# EAGLE design tvc-soundmagic-v1.3 (EAGLE 8.3.1)
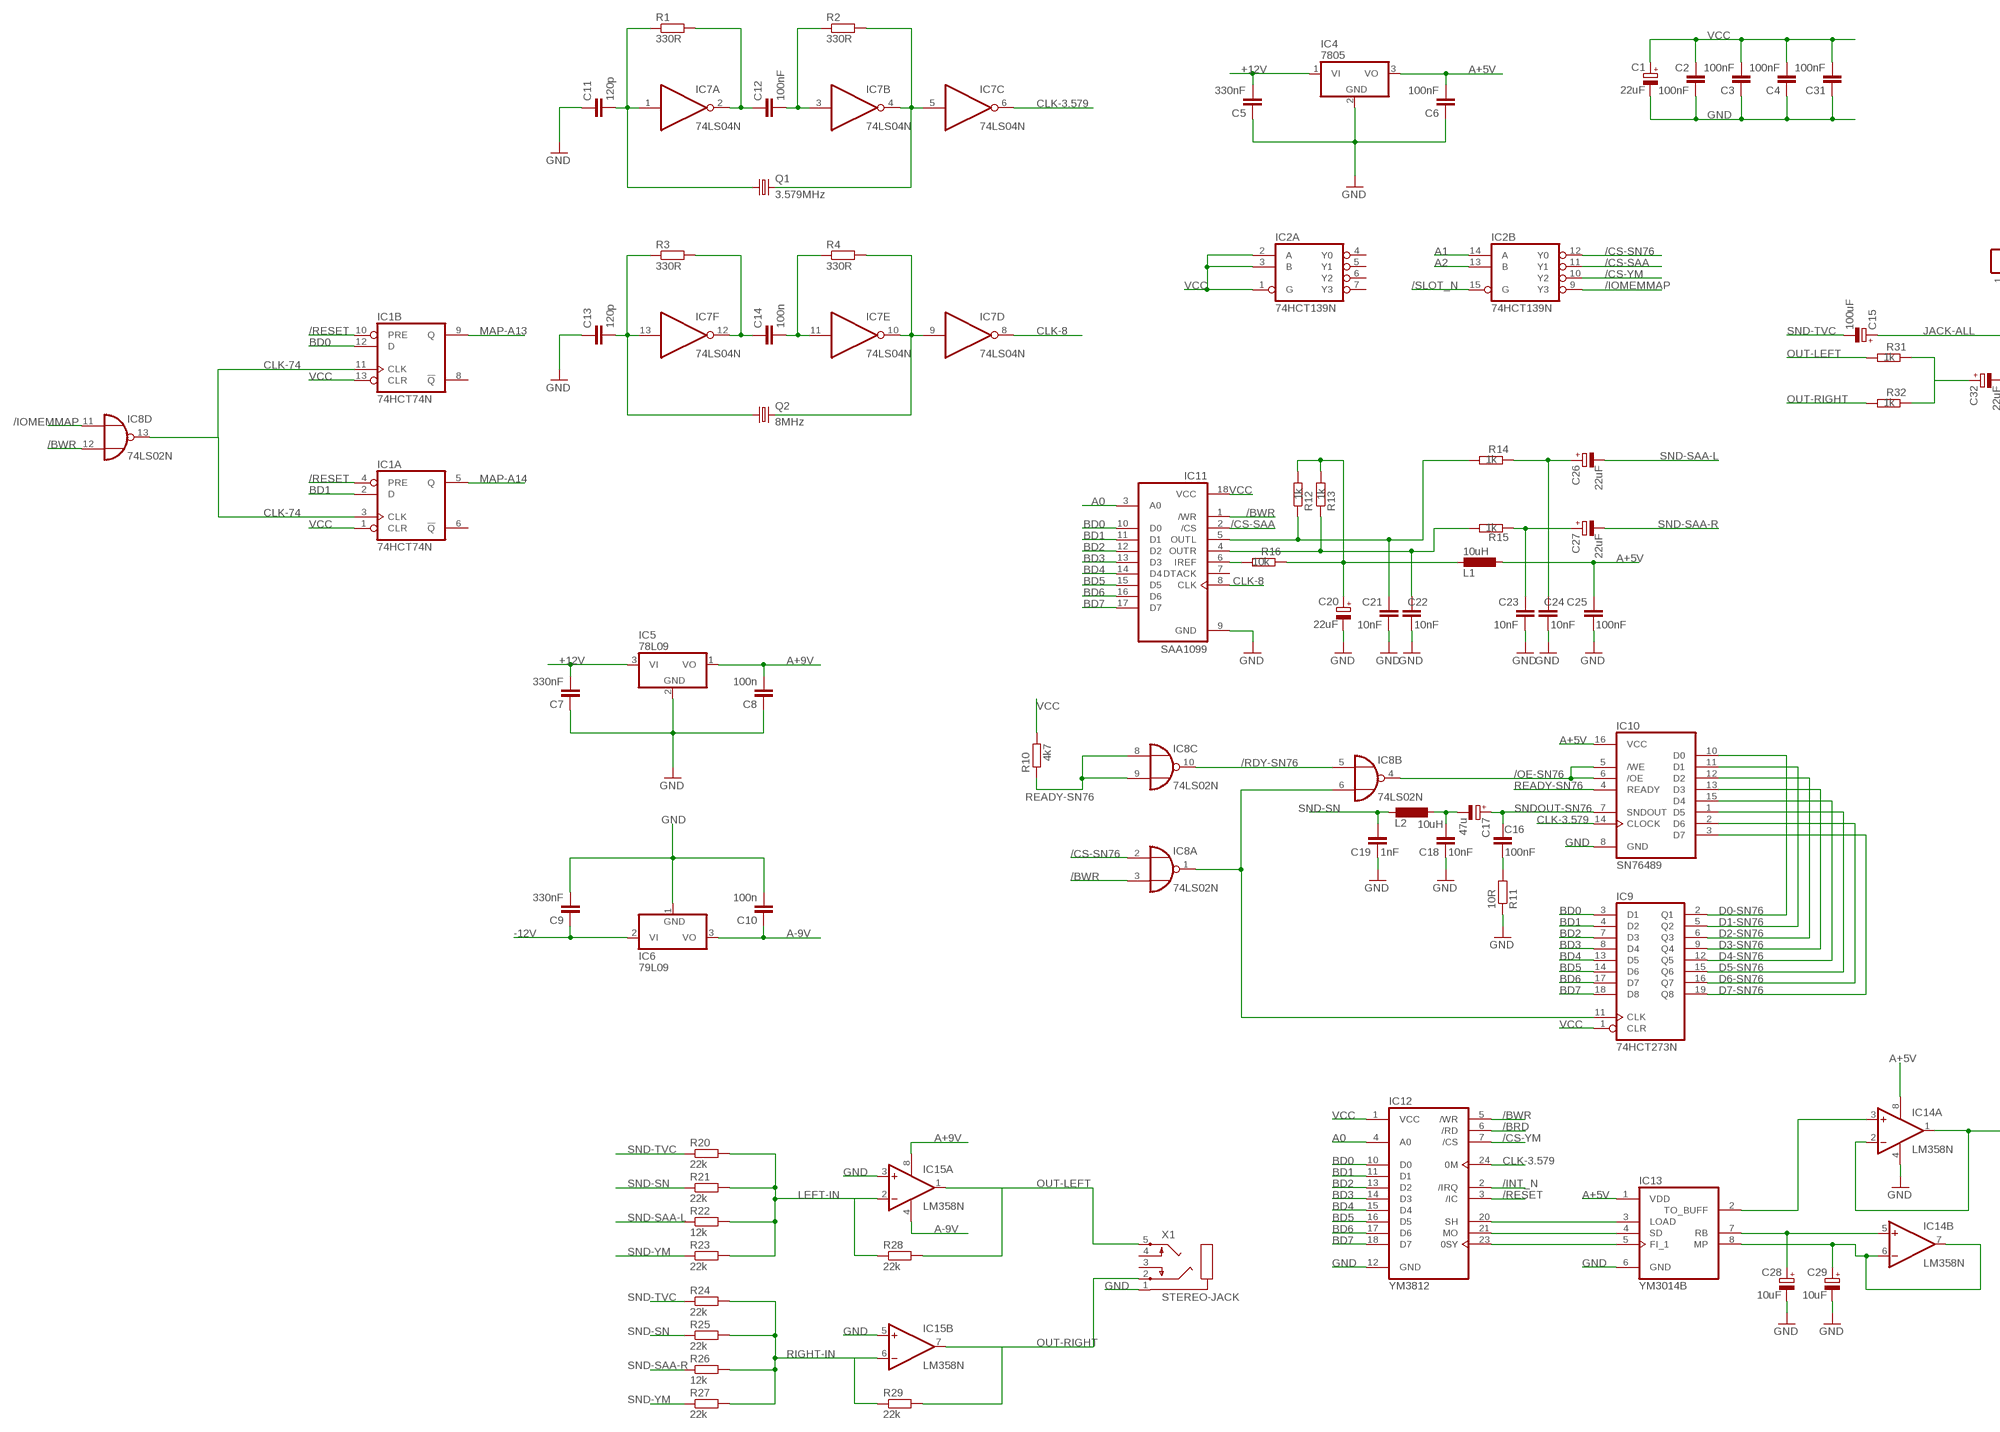
[diagram p0: schematic, sheet 1, part 1 of 2]
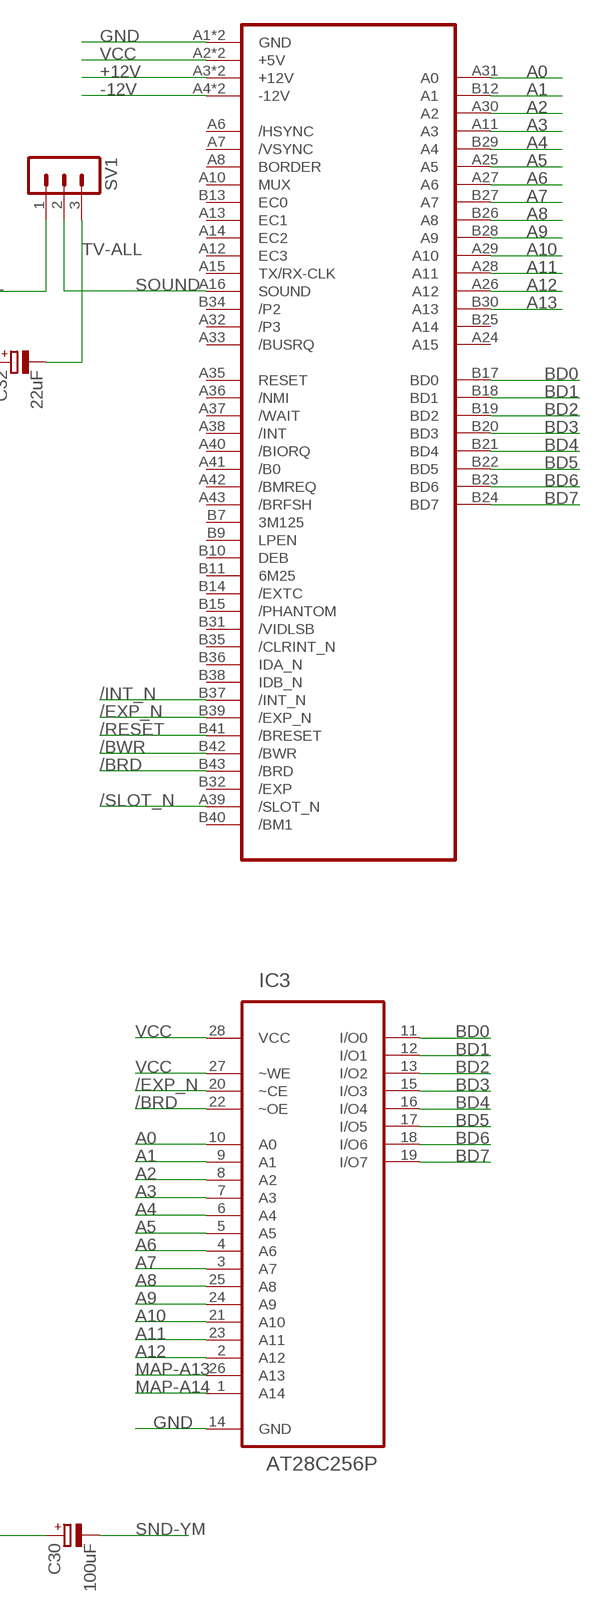
[diagram p1: schematic, sheet 1, part 2 of 2]

## Parts
C1  22uF  CPOL-EUE2.5-5  [E2,5-5]
C2  100nF  C2.5/2  [C2.5-2]
C3  100nF  C-EU025-024X044  [C025-024X044]
C4  100nF  C-EU025-024X044  [C025-024X044]
C5  330nF  C-EU050-025X075  [C050-025X075]
C6  100nF  C-EU025-024X044  [C025-024X044]
C7  330nF  C-EU050-025X075  [C050-025X075]
C8  100n  C-EU025-024X044  [C025-024X044]
C9  330nF  C-EU050-025X075  [C050-025X075]
C10  100n  C-EU025-024X044  [C025-024X044]
C11  120p  C-EU025-024X044  [C025-024X044]
C12  100nF  C-EU025-024X044  [C025-024X044]
C13  120p  C-EU025-024X044  [C025-024X044]
C14  100n  C-EU025-024X044  [C025-024X044]
C15  100uF  CPOL-EUE2.5-5  [E2,5-5]
C16  100nF  C2.5/2  [C2.5-2]
C17  47u  CPOL-EUE2.5-6  [E2,5-6]
C18  10nF  C2.5/2  [C2.5-2]
C19  1nF  C2.5/2  [C2.5-2]
C20  22uF  CPOL-EUE2.5-5  [E2,5-5]
C21  10nF  C2.5/2  [C2.5-2]
C22  10nF  C2.5/2  [C2.5-2]
C23  10nF  C2.5/2  [C2.5-2]
C24  10nF  C2.5/2  [C2.5-2]
C25  100nF  C2.5/2  [C2.5-2]
C26  22uF  CPOL-EUE2.5-5  [E2,5-5]
C27  22uF  CPOL-EUE2.5-5  [E2,5-5]
C28  10uF  CPOL-EUE2.5-5  [E2,5-5]
C29  10uF  CPOL-EUE2.5-5  [E2,5-5]
C30  100uF  CPOL-EUE2.5-5  [E2,5-5]
C31  100nF  C-EU025-024X044  [C025-024X044]
C32  22uF  CPOL-EUE2.5-5  [E2,5-5]
IC1  74HCT74N  [DIL14]
IC2  74HCT139N  [DIL16]
IC3  AT28C256P  [DIL28-6]
IC4  7805  7805T  [TO220H]
IC5  78L09  [TO92]
IC6  79L09  [TO92]
IC7  74LS04N  [DIL14]
IC8  74LS02N  [DIL14]
IC9  74HCT273N  [DIL20]
IC10  SN76489  [DIL16]
IC11  SAA1099  [DIL18]
IC12  YM3812  [DIL24-6]
IC13  YM3014B  [DIL08]
IC14  LM358N  [DIL08]
IC15  LM358N  [DIL08]
L1  10uH  L-EU0207/10  [0207/10]
L2  10uH  L-EU0207/10  [0207/10]
Q1  3.579MHz  CRYSTALHC49S  [HC49/S]
Q2  8MHz  CRYSTALHC49S  [HC49/S]
R1  330R  R-EU_0204/5  [0204/5]
R2  330R  R-EU_0204/5  [0204/5]
R3  330R  R-EU_0204/5  [0204/5]
R4  330R  R-EU_0204/5  [0204/5]
R10  4k7  R-EU_0207/7  [0207/7]
R11  10R  R-EU_0207/7  [0207/7]
R12  1k  R-EU_0207/7  [0207/7]
R13  1k  R-EU_0207/7  [0207/7]
R14  1k  R-EU_0207/7  [0207/7]
R15  1k  R-EU_0207/7  [0207/7]
R16  10k  R-EU_0207/7  [0207/7]
R20  22k  R-EU_0204/5  [0204/5]
R21  22k  R-EU_0204/5  [0204/5]
R22  12k  R-EU_0204/5  [0204/5]
R23  22k  R-EU_0204/5  [0204/5]
R24  22k  R-EU_0204/5  [0204/5]
R25  22k  R-EU_0204/5  [0204/5]
R26  12k  R-EU_0204/5  [0204/5]
R27  22k  R-EU_0204/5  [0204/5]
R28  22k  R-EU_0204/5  [0204/5]
R29  22k  R-EU_0204/5  [0204/5]
R31  1k  R-EU_0207/7  [0207/7]
R32  1k  R-EU_0207/7  [0207/7]
SV1  MA03-1  [MA03-1]
U$3  TVC-EXP-HBA-COMMON  [TVC-EXP-EDGE]
X1  STEREO-JACK  [ST-JACK-100]

## Nets
+12V [power]: C5.2 C7.2 IC4.1(VI) IC5.3(VI) U$3.A3(+12V) U$3.B3(+12V)
-12V [power]: C9.1 IC6.2(VI) U$3.A4(-12V) U$3.B4(-12V)
/BRD: IC3.22(~OE) IC12.6(/RD) U$3.B43(/BRD)
/BWR: IC8.3(A:I1) IC8.12(D:I1) IC11.1(/WR) IC12.5(/WR) U$3.B42(/BWR)
/CS-SAA: IC2.11(B:Y1) IC11.2(/CS)
/CS-SN76: IC2.12(B:Y0) IC8.2(A:I0)
/CS-YM: IC2.10(B:Y2) IC12.7(/CS)
/EXP_N: IC3.20(~CE) U$3.B39(/EXP_N)
/INT_N: IC12.2(/IRQ) U$3.B37(/INT_N)
/IOMEMMAP: IC2.9(B:Y3) IC8.11(D:I0)
/OE-SN76: IC8.4(B:O) IC10.5(/WE) IC10.6(/OE)
/RDY-SN76: IC8.5(B:I0) IC8.10(C:O)
/RESET: IC1.4(A:PRE) IC1.10(B:PRE) IC12.3(/IC) U$3.B41(/BRESET)
/SLOT_N: IC2.15(B:G) U$3.A39(/SLOT_N)
A0: IC3.10(A0) IC11.3(A0) IC12.4(A0) U$3.A31(A0)
A1: IC2.14(B:A) IC3.9(A1) U$3.B12(A1)
A2: IC2.13(B:B) IC3.8(A2) U$3.A30(A2)
A3: IC3.7(A3) U$3.A11(A3)
A4: IC3.6(A4) U$3.B29(A4)
A5: IC3.5(A5) U$3.A25(A5)
A6: IC3.4(A6) U$3.A27(A6)
A7: IC3.3(A7) U$3.B27(A7)
A8: IC3.25(A8) U$3.B26(A8)
A9: IC3.24(A9) U$3.B28(A9)
A10: IC3.21(A10) U$3.A29(A10)
A11: IC3.23(A11) U$3.A28(A11)
A12: IC3.2(A12) U$3.A26(A12)
A13: U$3.B30(A13)
A+5V [power]: C6.2 C25.1 IC4.3(VO) IC10.16(VCC) IC13.1(VDD) IC14.8(P:V+) L1.1
A+9V [power]: C8.2 IC5.1(VO) IC15.8(P:V+)
A-9V [power]: C10.1 IC6.3(VO) IC15.4(P:V-)
BD0: IC1.12(B:D) IC3.11(I/O0) IC9.3(D1) IC11.10(D0) IC12.10(D0) U$3.B17(BD0)
BD1: IC1.2(A:D) IC3.12(I/O1) IC9.4(D2) IC11.11(D1) IC12.11(D1) U$3.B18(BD1)
BD2: IC3.13(I/O2) IC9.7(D3) IC11.12(D2) IC12.13(D2) U$3.B19(BD2)
BD3: IC3.15(I/O3) IC9.8(D4) IC11.13(D3) IC12.14(D3) U$3.B20(BD3)
BD4: IC3.16(I/O4) IC9.13(D5) IC11.14(D4) IC12.15(D4) U$3.B21(BD4)
BD5: IC3.17(I/O5) IC9.14(D6) IC11.15(D5) IC12.16(D5) U$3.B22(BD5)
BD6: IC3.18(I/O6) IC9.17(D7) IC11.16(D6) IC12.17(D6) U$3.B23(BD6)
BD7: IC3.19(I/O7) IC9.18(D8) IC11.17(D7) IC12.18(D7) U$3.B24(BD7)
CLK-3.579: IC7.6(C:O) IC10.14(CLOCK) IC12.24(0M)
CLK-8: IC7.8(D:O) IC11.8(CLK)
CLK-74: IC1.3(A:CLK) IC1.11(B:CLK) IC8.13(D:O)
D0-SN76: IC9.2(Q1) IC10.10(D0)
D1-SN76: IC9.5(Q2) IC10.11(D1)
D2-SN76: IC9.6(Q3) IC10.12(D2)
D3-SN76: IC9.9(Q4) IC10.13(D3)
D4-SN76: IC9.12(Q5) IC10.15(D4)
D5-SN76: IC9.15(Q6) IC10.1(D5)
D6-SN76: IC9.16(Q7) IC10.2(D6)
D7-SN76: IC9.19(Q8) IC10.3(D7)
GND [power]: C1.- C2.2 C3.1 C4.1 C5.1 C6.1 C7.1 C8.1 C9.2 C10.2 C11.1 C13.1 C18.2 C19.2 C20.- C21.2 C22.2 C23.2 C24.2 C25.2 C28.- C29.- C31.1 IC3.14(GND) IC4.2(GND) IC5.2(GND) IC6.1(GND) IC10.8(GND) IC11.9(GND) IC12.12(GND) IC13.6(GND) IC14.4(P:V-) IC15.3(A:+IN) IC15.5(B:+IN) R11.1 U$3.A1(GND) U$3.B1(GND) X1.1(SHIELD)
JACK-ALL: C15.+ SV1.1
LEFT-IN: IC15.2(A:-IN) R20.2 R21.2 R22.2 R23.2 R28.1
MAP-A13: IC1.9(B:Q) IC3.26(A13)
MAP-A14: IC1.5(A:Q) IC3.1(A14)
N$1: C21.1 IC11.5(OUTL) R12.1 R14.2
N$2: C22.1 IC11.4(OUTR) R13.1 R15.2
N$3: C20.+ L1.2 R12.2 R13.2 R16.1
N$4: IC11.6(IREF) R16.2
N$5: C32.+ R31.1 R32.1
N$6: C11.2 IC7.1(A:I) Q1.1 R1.1
N$7: C12.1 IC7.2(A:O) R1.2
N$8: C12.2 IC7.3(B:I) R2.1
N$9: IC8.1(A:O) IC8.6(B:I1) IC9.11(CLK)
N$11: C23.1 C27.+ R15.1
N$12: C24.1 C26.+ R14.1
N$13: C16.2 R11.2
N$14: IC12.20(SH) IC13.3(LOAD)
N$21: IC12.21(MO) IC13.4(SD)
N$22: IC7.4(B:O) IC7.5(C:I) Q1.2 R2.2
N$23: C13.2 IC7.13(F:I) Q2.1 R3.1
N$24: IC12.23(0SY) IC13.5(FI_1)
N$25: C28.+ IC13.7(RB) IC14.5(B:+IN)
N$26: C14.1 IC7.12(F:O) R3.2
N$27: C14.2 IC7.11(E:I) R4.1
N$28: C17.- C18.1 L2.1
N$29: IC7.9(D:I) IC7.10(E:O) Q2.2 R4.2
N$30: C30.+ IC14.1(A:OUT) IC14.2(A:-IN)
N$31: IC13.2(TO_BUFF) IC14.3(A:+IN)
N$34: C29.+ IC13.8(MP) IC14.6(B:-IN) IC14.7(B:OUT)
OUT-LEFT: IC15.1(A:OUT) R28.2 R31.2 X1.5(LEFT)
OUT-RIGHT: IC15.7(B:OUT) R29.2 R32.2 X1.2(RIGHT)
READY-SN76: IC8.8(C:I0) IC8.9(C:I1) IC10.4(READY) R10.1
RIGHT-IN: IC15.6(B:-IN) R24.2 R25.2 R26.2 R27.2 R29.1
SND-SAA-L: C26.- R22.1
SND-SAA-R: C27.- R26.1
SND-SN: C19.1 L2.2 R21.1 R25.1
SND-TVC: C15.- R20.1 R24.1
SND-YM: C30.- R23.1 R27.1
SNDOUT-SN76: C16.1 C17.+ IC10.7(SNDOUT)
SOUND: SV1.2 U$3.A16(SOUND)
TV-ALL: C32.- SV1.3
VCC [power]: C1.+ C2.1 C3.2 C4.2 C31.2 IC1.1(A:CLR) IC1.13(B:CLR) IC2.1(A:G) IC2.2(A:A) IC2.3(A:B) IC3.27(~WE) IC3.28(VCC) IC9.1(CLR) IC11.18(VCC) IC12.1(VCC) R10.2 U$3.A2(+5V) U$3.B2(+5V)
Unconnected: IC1.6(A:!Q) IC1.8(B:!Q) IC2.4(A:Y0) IC2.5(A:Y1) IC2.6(A:Y2) IC2.7(A:Y3) IC11.7(DTACK) U$3.A6(/HSYNC) U$3.A7(/VSYNC) U$3.A8(BORDER) U$3.A10(MUX) U$3.A12(EC3) U$3.A13(EC1) U$3.A14(EC2) U$3.A15(TX/RX-CLK) U$3.A24(A15) U$3.A32(/P3) U$3.A33(/BUSRQ) U$3.A35(RESET) U$3.A36(/NMI) U$3.A37(/WAIT) U$3.A38(/INT) U$3.A40(/BIORQ) U$3.A41(/B0) U$3.A42(/BMREQ) U$3.A43(/BRFSH) U$3.B7(3M125) U$3.B9(LPEN) U$3.B10(DEB) U$3.B11(6M25) U$3.B13(EC0) U$3.B14(/EXTC) U$3.B15(/PHANTOM) U$3.B25(A14) U$3.B31(/VIDLSB) U$3.B32(/EXP) U$3.B34(/P2) U$3.B35(/CLRINT_N) U$3.B36(IDA_N) U$3.B38(IDB_N) U$3.B40(/BM1) X1.3(R-SWITCH) X1.4(L-SWITCH)

## Power pins joined to a net without a drawn wire
GND: IC1.7(P:GND) IC2.8(P:GND) IC7.7(P:GND) IC8.7(P:GND) IC9.10(GND)
VCC: IC1.14(P:VCC) IC2.16(P:VCC) IC7.14(P:VCC) IC8.14(P:VCC) IC9.20(VCC)

## Library data of the parts
C1 C15 C20 C26-C30 C32 = rcl:CPOL-EU: POLARIZED CAPACITOR, European symbol
C2 C16 C18 C19 C21-C25 = capacitor-wima:C: CAPACITOR naming: grid - package width
C3-C14 C31 = rcl:C-EU: CAPACITOR, European symbol
C17 = resistor:CPOL-EU: POLARIZED CAPACITOR, European symbol
IC1 = 74xx-eu:74*74: Dual D type positive edge triggered FLIP FLOP, preset and clear
IC2 = 74xx-eu:74*139: Dual 2-line to 4-line DECODER/DEMULTIPLEXER
IC3 = AT28C256:AT28C256P
IC4 = linear:78*: Positive VOLTAGE REGULATOR Source: http://cache.national.com/ds/LM/LM78L05.pdf http://www.fairchildsemi.com/ds/LM/LM7805.pdf
IC5 = linear-9V:78L09
IC6 = linear-9V:79L09
IC7 = 74xx-eu:74*04: Hex INVERTER
IC8 = 74xx-eu:74*02: Quad 2-input NOR gate
IC9 = 74xx-eu:74*273: Octal D type FLIP FLOP, clear
IC10 = sn76489:SN76489
IC11 = SAA1099:SAA1099
IC12 = Yamaha-OPL2:YM3812
IC13 = Yamaha-OPL2:YM3014B
IC14 IC15 = linear:LM358: OP AMP also LM158; LM258; LM2904 Source: http://cache.national.com/ds/LM/LM158.pdf
L1 L2 = resistor:L-EU: INDUCTOR, European symbol
Q1 Q2 = crystal:CRYSTAL: CRYSTAL; OC_FARNELL: 1667008; OC_NEWARK: unknown
R1-R4 R10-R16 R20-R29 R31 R32 = resistor:R-EU_: RESISTOR, European symbol
SV1 = con-lstb:MA03-1: PIN HEADER; OC_FARNELL: unknown; OC_NEWARK: unknown
U$3 = tvc-exp:TVC-EXP-HBA-COMMON: Videoton TV-Computer expansion port edge connector, common pins for 32k, 64k and 64k+
X1 = stereo-100:STEREO-JACK

## Net classes
0 default: width 0.254 mm
1 power: width 0.508 mm, drill 0.508 mm

## Board
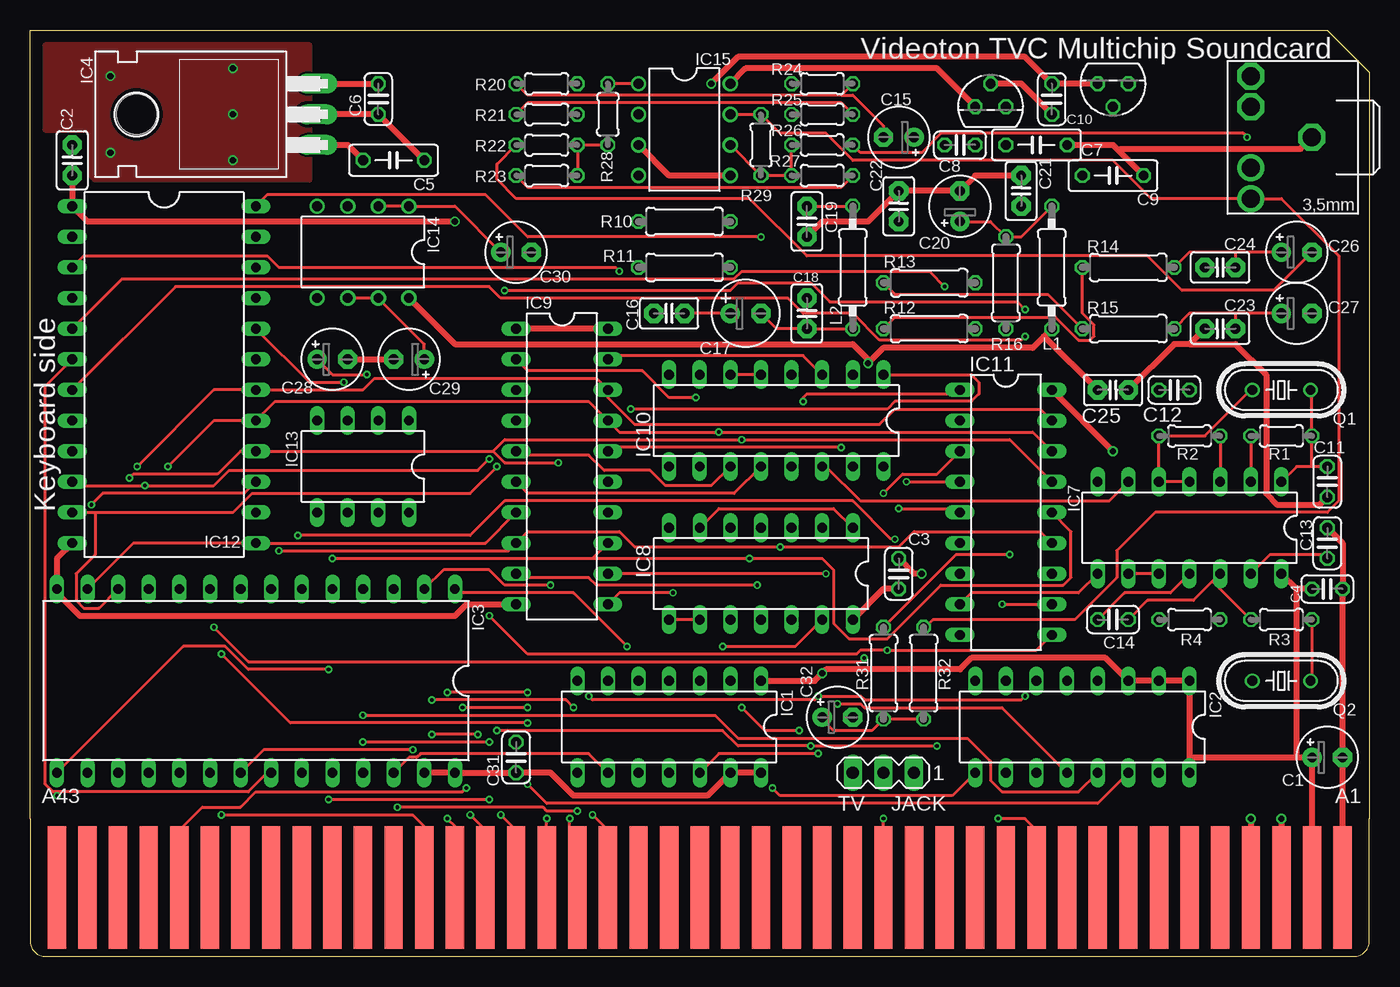
[diagram p2: board, top side]
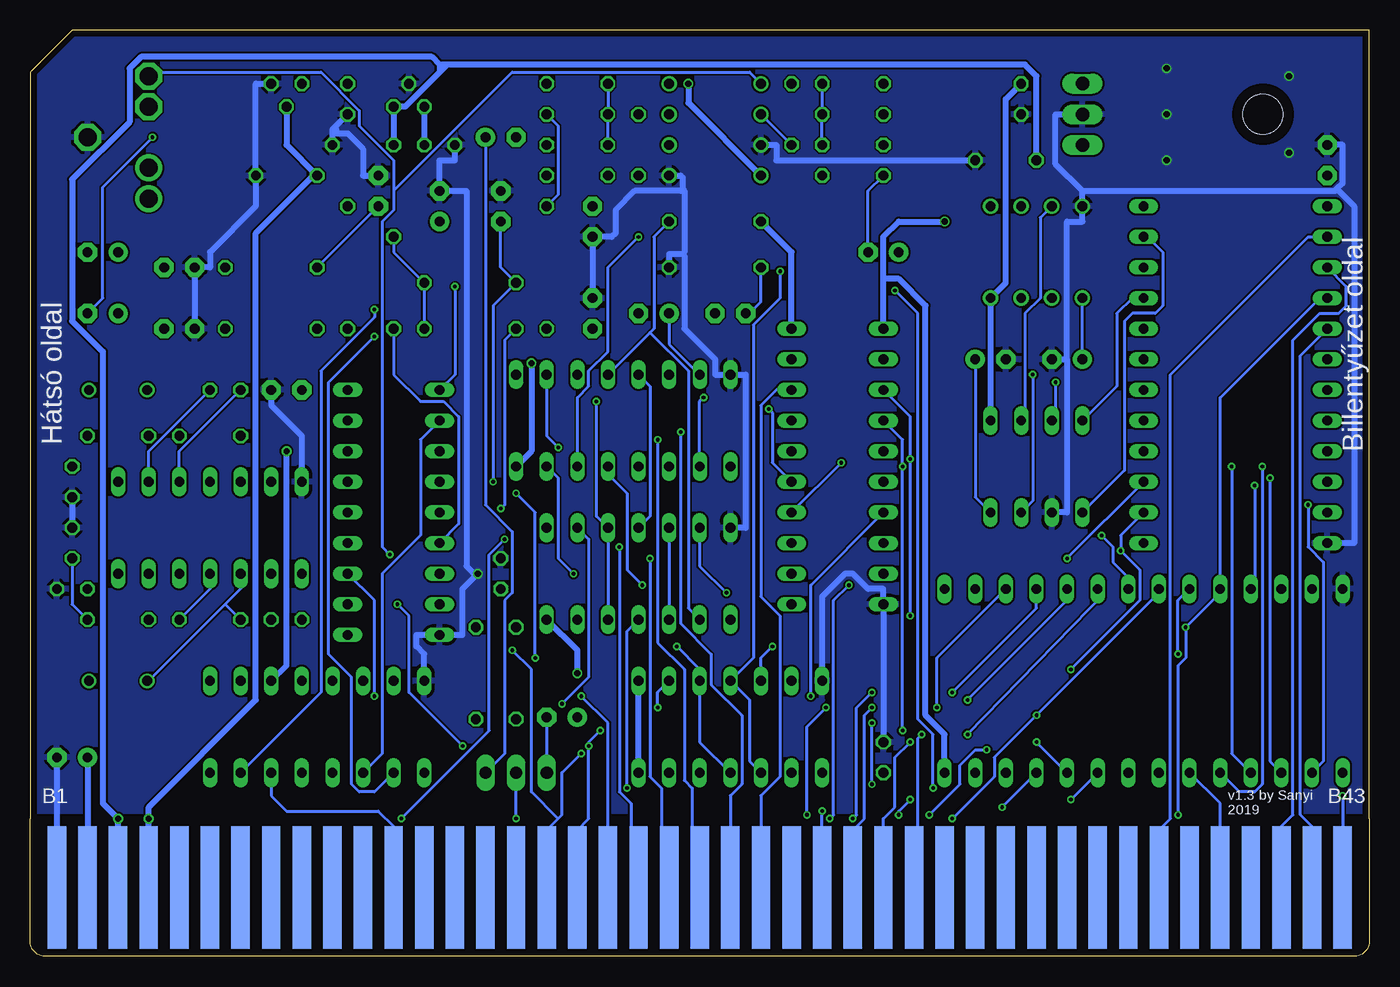
[diagram p3: board, bottom side, seen from below]

Size 111.12 x 76.83 mm. Coordinates in mm from the lower left corner, seen from the top.
Outline: 0,11.43 0,76.83 107.63,76.83 111.12,73.34 111.12,11.43
Copper layers (1*16): Top 0.035mm / dielectric 1.6mm / Bottom 0.035mm
Design rules "Elecrow_2-layer_PCB_eagle_rule": minimum track width 6mil, minimum drill 12mil, track to track 6mil, track to pad 6mil, pad to pad 6mil, via to via 8mil, smd to smd 0mil, copper to edge 20mil, drill to drill 10mil, minimum pad ring 6mil, minimum via ring 6mil, stop-mask expansion 0mil, vias tented up to drill 100mil, thermal gap 10mil

### Footprints (pad centres in the part's own frame; a part is rotated, then mirrored left to right if it is on the bottom)
E2,5-5 = drill 0.813 pad 1.6: + -1.27,0 | drill 0.813 pad 1.6 octagon: - 1.27,0
C2.5-2 = drill 0.813 pad 1.6 octagon: 1 -1.27,0; 2 1.27,0
C025-024X044 = drill 0.813 octagon: 1 -1.27,0; 2 1.27,0
C050-025X075 = drill 0.813 octagon: 1 -2.54,0; 2 2.54,0
E2,5-6 = drill 0.813 pad 1.6: + -1.27,0 | drill 0.813 pad 1.6 octagon: - 1.27,0
DIL14 = drill 0.813 long: 1 -7.62,-3.81; 2 -5.08,-3.81; 3 -2.54,-3.81; 4 0,-3.81; 5 2.54,-3.81; 6 5.08,-3.81; 7 7.62,-3.81; 8 7.62,3.81; 9 5.08,3.81; 10 2.54,3.81; 11 0,3.81; 12 -2.54,3.81; 13 -5.08,3.81; 14 -7.62,3.81
DIL16 = drill 0.813 long: 1 -8.89,-3.81; 2 -6.35,-3.81; 3 -3.81,-3.81; 4 -1.27,-3.81; 5 1.27,-3.81; 6 3.81,-3.81; 7 6.35,-3.81; 8 8.89,-3.81; 9 8.89,3.81; 10 6.35,3.81; 11 3.81,3.81; 12 1.27,3.81; 13 -1.27,3.81; 14 -3.81,3.81; 15 -6.35,3.81; 16 -8.89,3.81
DIL28-6 = drill 0.813 long: 1 -16.51,-7.62; 2 -13.97,-7.62; 3 -11.43,-7.62; 4 -8.89,-7.62; 5 -6.35,-7.62; 6 -3.81,-7.62; 7 -1.27,-7.62; 8 1.27,-7.62; 9 3.81,-7.62; 10 6.35,-7.62; 11 8.89,-7.62; 12 11.43,-7.62; 13 13.97,-7.62; 14 16.51,-7.62; 15 16.51,7.62; 16 13.97,7.62; 17 11.43,7.62; 18 8.89,7.62; 19 6.35,7.62; 20 3.81,7.62; 21 1.27,7.62; 22 -1.27,7.62; 23 -3.81,7.62; 24 -6.35,7.62; 25 -8.89,7.62; 26 -11.43,7.62; 27 -13.97,7.62; 28 -16.51,7.62
TO220H = drill 1.118 long: 1 -2.54,-10.16; 2 0,-10.16; 3 2.54,-10.16 | hole 3.302: 0,4.826
TO92 = drill 0.813 octagon: 1 -1.27,0; 2 0,1.905; 3 1.27,0
DIL20 = drill 0.813 long: 1 -11.43,-3.81; 2 -8.89,-3.81; 3 -6.35,-3.81; 4 -3.81,-3.81; 5 -1.27,-3.81; 6 1.27,-3.81; 7 3.81,-3.81; 8 6.35,-3.81; 9 8.89,-3.81; 10 11.43,-3.81; 11 11.43,3.81; 12 8.89,3.81; 13 6.35,3.81; 14 3.81,3.81; 15 1.27,3.81; 16 -1.27,3.81; 17 -3.81,3.81; 18 -6.35,3.81; 19 -8.89,3.81; 20 -11.43,3.81
DIL18 = drill 0.813 long: 1 -10.16,-3.81; 2 -7.62,-3.81; 3 -5.08,-3.81; 4 -2.54,-3.81; 5 0,-3.81; 6 2.54,-3.81; 7 5.08,-3.81; 8 7.62,-3.81; 9 10.16,-3.81; 10 10.16,3.81; 11 7.62,3.81; 12 5.08,3.81; 13 2.54,3.81; 14 0,3.81; 15 -2.54,3.81; 16 -5.08,3.81; 17 -7.62,3.81; 18 -10.16,3.81
DIL24-6 = drill 0.813 long: 1 -13.97,-7.62; 2 -11.43,-7.62; 3 -8.89,-7.62; 4 -6.35,-7.62; 5 -3.81,-7.62; 6 -1.27,-7.62; 7 1.27,-7.62; 8 3.81,-7.62; 9 6.35,-7.62; 10 8.89,-7.62; 11 11.43,-7.62; 12 13.97,-7.62; 13 13.97,7.62; 14 11.43,7.62; 15 8.89,7.62; 16 6.35,7.62; 17 3.81,7.62; 18 1.27,7.62; 19 -1.27,7.62; 20 -3.81,7.62; 21 -6.35,7.62; 22 -8.89,7.62; 23 -11.43,7.62; 24 -13.97,7.62
DIL08 = drill 0.813 long: 1 -3.81,-3.81; 2 -1.27,-3.81; 3 1.27,-3.81; 4 3.81,-3.81; 5 3.81,3.81; 6 1.27,3.81; 7 -1.27,3.81; 8 -3.81,3.81
DIL08' = drill 0.813 pad 1.27: 1 -3.81,-3.81; 2 -1.27,-3.81; 3 1.27,-3.81; 4 3.81,-3.81; 5 3.81,3.81; 6 1.27,3.81; 7 -1.27,3.81; 8 -3.81,3.81
0207/10 = drill 0.813 octagon: 1 -5.08,0; 2 5.08,0
HC49/S = drill 0.813: 1 -2.413,0; 2 2.413,0
0204/5 = drill 0.813 octagon: 1 -2.54,0; 2 2.54,0
0207/7 = drill 0.813 octagon: 1 -3.81,0; 2 3.81,0
MA03-1 = drill 1.016 long: 1 -2.54,0; 2 0,0; 3 2.54,0
TVC-EXP-EDGE = smd 1.524 x 10.16: A1 53.34,-5.715; A2 50.8,-5.715; A3 48.26,-5.715; A4 45.72,-5.715; A5 43.18,-5.715; A6 40.64,-5.715; A7 38.1,-5.715; A8 35.56,-5.715; A9 33.02,-5.715; A10 30.48,-5.715; A11 27.94,-5.715; A12 25.4,-5.715; A13 22.86,-5.715; A14 20.32,-5.715; A15 17.78,-5.715; A16 15.24,-5.715; A17 12.7,-5.715; A18 10.16,-5.715; A19 7.62,-5.715; A20 5.08,-5.715; A21 2.54,-5.715; A22 0,-5.715; A23 -2.54,-5.715; A24 -5.08,-5.715; A25 -7.62,-5.715; A26 -10.16,-5.715; A27 -12.7,-5.715; A28 -15.24,-5.715; A29 -17.78,-5.715; A30 -20.32,-5.715; A31 -22.86,-5.715; A32 -25.4,-5.715; A33 -27.94,-5.715; A34 -30.48,-5.715; A35 -33.02,-5.715; A36 -35.56,-5.715; A37 -38.1,-5.715; A38 -40.64,-5.715; A39 -43.18,-5.715; A40 -45.72,-5.715; A41 -48.26,-5.715; A42 -50.8,-5.715; A43 -53.34,-5.715 | smd 1.524 x 10.16 bottom: B1 53.34,-5.715; B2 50.8,-5.715; B3 48.26,-5.715; B4 45.72,-5.715; B5 43.18,-5.715; B6 40.64,-5.715; B7 38.1,-5.715; B8 35.56,-5.715; B9 33.02,-5.715; B10 30.48,-5.715; B11 27.94,-5.715; B12 25.4,-5.715; B13 22.86,-5.715; B14 20.32,-5.715; B15 17.78,-5.715; B16 15.24,-5.715; B17 12.7,-5.715; B18 10.16,-5.715; B19 7.62,-5.715; B20 5.08,-5.715; B21 2.54,-5.715; B22 0,-5.715; B23 -2.54,-5.715; B24 -5.08,-5.715; B25 -7.62,-5.715; B26 -10.16,-5.715; B27 -12.7,-5.715; B28 -15.24,-5.715; B29 -17.78,-5.715; B30 -20.32,-5.715; B31 -22.86,-5.715; B32 -25.4,-5.715; B33 -27.94,-5.715; B34 -30.48,-5.715; B35 -33.02,-5.715; B36 -35.56,-5.715; B37 -38.1,-5.715; B38 -40.64,-5.715; B39 -43.18,-5.715; B40 -45.72,-5.715; B41 -48.26,-5.715; B42 -50.8,-5.715; B43 -53.34,-5.715
ST-JACK-100 = drill 1.499 octagon: 1 -5.08,0; 4 0,-2.54; 5 0,-5.08 | drill 1.499: 2 0,5.08; 3 0,2.54

### Placement (x,y rotation side)
C1  107.63,16.51 0 top
C2  3.49,66.04 90 top
C3  72.07,31.75 270 top
C4  107.63,30.48 180 top
C5  30.16,66.04 180 top
C6  28.89,71.12 90 top
C7  83.5,67.31 180 top
C8  77.15,67.31 0 top
C9  89.85,64.77 0 top
C10  84.77,71.12 270 top
C11  107.63,39.37 90 top
C12  94.93,46.99 180 top
C13  107.63,34.29 270 top
C14  89.85,27.94 180 top
C15  72.07,67.94 180 top
C16  53.02,53.34 180 top
C17  59.37,53.34 0 top
C18  64.45,53.34 90 top
C19  64.45,60.96 270 top
C20  77.15,62.23 90 top
C21  82.23,63.5 90 top
C22  72.07,62.23 90 top
C23  98.74,52.07 180 top
C24  98.74,57.15 180 top
C25  89.85,46.99 0 top
C26  105.09,58.42 0 top
C27  105.09,53.34 0 top
C28  25.08,49.53 0 top
C29  31.43,49.53 180 top
C30  40.32,58.42 0 top
C31  40.32,16.51 270 top
C32  66.99,19.84 0 top
IC1  53.02,19.05 180 top
IC2  87.31,19.05 180 top
IC3  18.73,22.86 180 top
IC4  13.65,69.85 90 top
IC5  79.69,70.48 0 top
IC6  89.85,72.39 180 top
IC7  96.2,35.56 180 top
IC8  60.64,31.75 180 top
IC9  44.13,40.64 270 top
IC10  61.91,44.45 180 top
IC11  80.96,36.83 270 top
IC12  11.11,48.26 270 top
IC13  27.62,40.64 180 top
IC14  LM358N  [DIL08']  27.62,58.42 180 top
IC15  LM358N  [DIL08']  54.29,68.58 270 top
L1  84.77,57.15 90 top
L2  68.26,57.15 90 top
Q1  103.82,46.99 180 top
Q2  103.82,22.86 180 top
R1  103.82,43.18 180 top
R2  96.2,43.18 180 top
R3  103.82,27.94 180 top
R4  96.2,27.94 180 top
R10  54.29,60.96 180 top
R11  54.29,57.15 180 top
R12  74.61,52.07 0 top
R13  74.61,55.88 0 top
R14  91.12,57.15 180 top
R15  91.12,52.07 180 top
R16  80.96,55.88 270 top
R20  42.86,72.39 0 top
R21  42.86,69.85 0 top
R22  42.86,67.31 0 top
R23  42.86,64.77 0 top
R24  65.72,72.39 180 top
R25  65.72,69.85 180 top
R26  65.72,67.31 180 top
R27  65.72,64.77 180 top
R28  47.94,69.85 90 top
R29  60.64,67.31 90 top
R31  70.8,23.5 90 top
R32  74.14,23.5 90 top
SV1  70.8,15.24 180 top
U$3  55.56,11.43 0 top
X1  101.28,67.94 180 top

### Tracks (layer width: path | path; a pad name or v marks a point on that pad's centre or on a via)
+12V  (via drill 0.51)
  Top 0.508: v103.82,11.43 U$3.B3 | C5.2 26.35,67.31 IC4.1
  Bottom 0.508: U$3.B3 v103.82,11.43 105.09,12.7 105.09,50.16 107.63,52.7 107.63,64.45 102.87,69.22 102.87,73.66 101.92,74.61 77.79,74.61 77.15,73.98 | C7.2 IC5.3 80.01,70.48 77.15,73.34 | 76.52,73.98 77.15,73.34 | 76.52,73.98 28.57,73.98 27.62,73.03 C5.2 | 76.52,73.98 77.15,73.98 | 77.15,73.98 77.15,73.34
-12V  (via drill 0.51)
  Top 0.508: v101.28,11.43 U$3.B4
  Bottom 0.508: IC6.2 89.85,67.31 C9.1 87.63,64.77 92.39,60.01 92.39,21.27 101.28,12.38 v101.28,11.43 U$3.B4
/BRD  (via drill 0.3)
  Top 0.254: IC12.6 1.27,47.31 1.27,14.29 1.91,13.65 2.22,13.65 | 2.22,13.65 18.1,13.65 19.69,15.24 IC3.22 | 2.22,13.65 v2.22,13.34
  Bottom 0.254: v2.22,13.34 U$3.B43
/BWR  (via drill 0.3)
  Top 0.254: IC11.1 76.84,46.67 64.45,46.67 64.14,46.35 v64.14,46.04 | v75.88,55.56 74.61,56.83 59.06,56.83 58.42,56.2 7.62,56.2 IC12.5
  Bottom 0.254: IC8.12 IC8.3 64.14,36.51 v64.14,46.04 | IC12.5 5.71,49.85 5.71,11.75 4.76,10.79 U$3.B42 | IC11.1 75.88,48.26 v75.88,55.56
/CS-SAA
  Bottom 0.254: IC2.11 81.92,16.83 81.92,31.75 78.74,34.92 78.74,42.86 IC11.2
/CS-SN76  (via drill 0.3)
  Top 0.254: IC2.12 80.65,20.64 69.21,20.64 68.9,20.95 v66.99,20.95
  Bottom 0.254: v66.99,20.95 64.77,23.18 64.77,34.61 IC8.2
/CS-YM  (via drill 0.3)
  Top 0.254: IC12.7 12.07,55.56 38.1,55.56 39.05,54.61 62.86,54.61 64.14,53.34 68.26,53.34 70.48,51.12 82.23,51.12 v82.55,51.44
  Bottom 0.254: v82.55,51.44 86.36,47.62 86.36,25.08 84.45,23.18 84.45,14.29 83.82,13.65 82.55,13.65 IC2.10
/EXP_N
  Bottom 0.254: IC3.20 12.38,12.7 U$3.B39
/INT_N
  Bottom 0.254: IC12.2 5.08,59.69 16.51,48.26 16.51,11.43 17.46,10.48 U$3.B37
/IOMEMMAP  (via drill 0.3)
  Top 0.254: v61.6,13.97 62.23,13.34 76.52,13.34 IC2.9
  Bottom 0.254: IC8.11 61.6,26.99 v61.6,13.97
/OE-SN76
  Top 0.254: IC10.5 IC10.6
  Bottom 0.254: IC8.4 59.69,36.51 59.69,47.31 IC10.5
/RDY-SN76
  Bottom 0.254: IC8.5 IC8.10
/RESET  (via drill 0.3)
  Top 0.254: v48.89,56.83 48.58,57.15 20.64,57.15 19.69,58.1 4.45,58.1 IC12.3
  Bottom 0.254: IC1.10 51.43,16.19 51.43,21.27 IC1.4 51.12,24.77 51.12,52.39 48.89,54.61 v48.89,56.83 | IC12.3 1.91,55.56 1.91,53.98 2.54,53.34 4.13,53.34 6.35,51.12 6.35,11.75 7.3,10.79 U$3.B41
/SLOT_N  (via drill 0.3)
  Top 0.254: v82.55,53.66 81.92,54.29 66.36,54.29 64.77,55.88 58.74,55.88 58.1,55.24 v39.37,55.24 | v36.2,13.97 35.88,13.65 18.73,13.65 17.46,12.38 14.29,12.38 12.38,10.48 U$3.A39
  Bottom 0.254: IC2.15 86.99,21.91 86.99,48.58 82.55,53.02 v82.55,53.66 | v39.37,55.24 37.46,53.34 37.46,19.68 36.2,18.41 v36.2,13.97
A0  (via drill 0.3)
  Top 0.254: IC11.3 75.25,40.01 72.39,40.01 v70.8,38.42 | v69.21,24.77 68.9,24.45 18.1,24.45 v15.24,27.3 | U$3.A31 32.7,10.79 31.75,11.75 v15.87,11.75
  Bottom 0.254: IC12.4 4.13,54.61 12.38,46.35 IC3.10 12.38,30.16 v15.24,27.3 15.24,24.77 15.87,24.13 v15.87,11.75 | v70.8,38.42 69.21,36.83 v69.21,24.77
A1  (via drill 0.3)
  Top 0.254: v15.87,25.08 21.59,19.37 v41.28,19.37 | v41.28,14.29 42.86,12.7 88.58,12.7 IC2.14
  Bottom 0.254: IC3.9 15.87,29.53 v15.87,25.08 | v41.28,14.29 v41.28,19.37 | U$3.B12 81.6,6.35 80.96,10.79 82.23,12.06 89.85,12.06 91.12,13.34 IC2.14
A2  (via drill 0.3)
  Top 0.254: IC2.13 86.99,13.65 80.65,13.65 79.69,14.61 79.69,16.19 77.79,18.1 58.74,18.1 56.83,20 v27.62,20 | v34.61,11.43 35.24,10.79 U$3.A30
  Bottom 0.254: IC3.8 17.46,30.16 v27.62,20 31.12,16.51 31.12,14.92 v34.61,11.43
A3  (via drill 0.3)
  Top 0.254: v22.23,34.92 36.51,34.92 39.37,37.78 68.26,37.78 71.44,34.61 v71.76,34.61 | v80.33,11.43 82.55,11.43 83.5,10.48 U$3.A11
  Bottom 0.254: IC3.7 20,31.43 21.27,32.7 21.27,33.97 v22.23,34.92 | v71.76,34.61 73.03,33.34 73.03,18.73 v80.33,11.43
A4  (via drill 0.3)
  Top 0.254: v37.15,18.41 v33.34,18.41
  Bottom 0.254: v33.34,18.41 23.18,28.89 22.54,29.53 IC3.6 | v37.15,18.41 37.46,18.1 37.46,6.03 U$3.B29
A5  (via drill 0.3)
  Top 0.254: v33.34,21.27 44.45,21.27 v45.09,20.64 | v46.67,11.75 47.94,10.48 U$3.A25
  Bottom 0.254: v33.34,21.27 25.08,29.53 IC3.5 | v45.09,20.64 46.67,19.05 v46.67,11.75
A6  (via drill 0.3)
  Top 0.254: v41.28,21.91 v34.61,21.91 | U$3.A27 v42.86,11.43
  Bottom 0.254: IC3.4 27.62,28.89 v34.61,21.91 | v41.28,21.91 42.54,20.64 42.54,11.75 v42.86,11.43
A7  (via drill 0.3)
  Top 0.254: v41.28,20.64 v35.88,20.64
  Bottom 0.254: IC3.3 35.88,24.77 v35.88,20.64 | v41.28,20.64 41.91,20 41.91,11.43 42.86,10.48 U$3.B27
A8  (via drill 0.3)
  Top 0.254: v30.48,12.38 42.54,12.38 42.86,12.06 v45.4,12.06
  Bottom 0.254: v30.48,12.38 IC3.25 | U$3.B26 v45.4,12.06
A9  (via drill 0.3)
  Top 0.254: v38.1,17.78 v27.62,17.78
  Bottom 0.254: v27.62,17.78 IC3.24 | v38.1,17.78 39.37,16.51 39.37,12.38 40.32,11.43 U$3.B28
A10  (via drill 0.3)
  Top 0.254: IC3.21 19.37,17.14 v31.75,17.14 | v36.51,11.75 37.78,10.48 U$3.A29
  Bottom 0.254: v31.75,17.14 32.7,17.14 33.97,15.88 33.97,14.29 v36.51,11.75
A11  (via drill 0.3)
  Top 0.254: v38.1,13.02 v24.76,13.02 | v39.05,11.75 40.32,10.48 U$3.A28
  Bottom 0.254: v24.76,13.02 IC3.23 | v38.1,13.02 39.05,12.06 v39.05,11.75
A12  (via drill 0.3)
  Top 0.254: IC3.2 34.29,32.07 38.1,32.07 39.37,30.8 v43.18,30.8 | v44.77,11.43 44.77,5.71 U$3.A26
  Bottom 0.254: v43.18,30.8 44.45,29.53 44.45,11.75 v44.77,11.43
A+5V  (via drill 0.51)
  Top 0.508: L1.1 84.14,51.44 | 84.14,51.44 C25.1 | 84.14,51.44 83.98,51.28 83.18,50.48 70.8,50.48 v69.53,49.21 69.53,49.53 68.26,50.8 35.24,50.8 IC14.8 | IC4.3 C6.2
  Bottom 0.508: IC10.16 69.53,41.91 v69.53,49.21 | IC13.1 IC14.8 30.16,55.88 30.16,71.12 C6.2
A+9V
  Top 0.508: IC15.8 59.37,73.66 75.25,73.66 IC5.1
  Bottom 0.508: IC5.1 C8.2
A-9V  (via drill 0.51)
  Top 0.508: IC6.3 C10.1 82.55,74.61 58.74,74.61 v56.52,72.39
  Bottom 0.508: IC15.4 56.52,70.8 v56.52,72.39
BD0  (via drill 0.3)
  Top 0.254: IC12.10 3.81,39.05 v9.52,39.05 15.24,39.05 16.51,40.32 37.15,40.32 v38.1,41.27 | IC1.12 57.15,16.83 v65.4,16.83 | IC11.10 83.5,25.4 v71.12,25.4 68.9,25.4 68.58,25.08 41.28,25.08 v38.1,28.26
  Bottom 0.254: IC3.11 9.52,30.8 v9.52,39.05 | IC9.3 38.1,44.77 v38.1,41.27 v38.1,28.26 | v65.4,16.83 66.99,15.24 66.99,11.75 67.31,11.43 | 67.31,11.43 68.26,10.48 U$3.B17 | v71.12,25.4 69.53,23.81 69.53,13.65 67.31,11.43
BD1  (via drill 0.3)
  Top 0.254: IC3.12 5.71,28.89 4.45,28.89 3.81,29.53 3.81,31.75 5.4,33.34 5.4,36.83 | IC12.11 5.4,36.83 | v38.74,40.64 36.51,38.42 18.42,38.42 16.83,36.83 5.4,36.83 | v59.06,20.64 60.96,18.73 v63.82,18.73 | v80.65,29.21 IC11.11 | v75.25,17.46 v64.77,17.46 58.74,17.46 57.47,18.73 v38.74,18.73
  Bottom 0.254: IC9.4 38.74,42.86 v38.74,40.64 v38.74,18.73 | IC1.2 59.06,21.91 v59.06,20.64 | v63.82,18.73 64.77,17.78 v64.77,17.46 64.77,11.43 65.72,10.48 U$3.B18 | v80.65,29.21 79.69,28.26 79.69,21.91 v75.25,17.46
BD2  (via drill 0.3)
  Top 0.254: IC3.13 8.57,34.29 IC12.13 37.78,34.29 IC9.7 | v82.55,21.59 82.23,21.27 69.21,21.27 68.9,21.59 v65.4,21.59 65.09,21.27 46.67,21.27 v46.35,21.59
  Bottom 0.254: IC11.12 82.55,29.53 v82.55,21.59 | v65.4,21.59 63.18,19.37 U$3.B19 | IC9.7 46.35,30.8 v46.35,21.59
BD3  (via drill 0.3)
  Top 0.254: IC3.15 12.7,25.72 16.19,25.72 18.1,23.81 v24.76,23.81 | v20.64,33.66 39.69,33.66 IC9.8 41.28,35.24 48.89,35.24 50.17,33.97 v62.23,33.97 72.07,33.97 73.34,35.24 83.82,35.24 IC11.13
  Bottom 0.254: v24.76,23.81 19.05,29.53 19.05,32.07 v20.64,33.66 20.64,34.92 IC12.14 | U$3.B20 61.28,6.35 61.28,12.7 62.23,13.65 v62.23,33.97
BD4  (via drill 0.3)
  Top 0.254: v5.08,37.47 6.03,38.42 17.78,38.42 IC12.15 | 46.67,33.02 IC9.13 | v25.08,33.02 46.67,33.02 | IC11.14 86.36,35.24 86.36,31.43 85.73,30.8 75.56,30.8 71.12,26.35 67.95,26.35 66.68,27.62 66.68,32.07 65.72,33.02 v59.69,33.02 46.67,33.02
  Bottom 0.254: IC3.16 3.81,16.19 3.81,32.7 5.08,33.97 v5.08,37.47 | IC12.15 v25.08,33.02 | U$3.B21 58.74,6.35 58.74,13.97 59.69,14.92 v59.69,33.02
BD5  (via drill 0.3)
  Top 0.254: v8.25,39.69 8.57,40.01 15.56,40.01 17.46,41.91 IC12.16 38.42,41.91 | v43.82,40.96 39.37,40.96 38.42,41.91 | IC11.15 81.28,42.86 v59.06,42.86 39.37,42.86 38.42,41.91
  Bottom 0.254: IC3.17 8.25,16.19 v8.25,39.69 | v43.82,40.96 IC9.14 | U$3.B22 56.2,6.35 56.2,13.97 56.83,14.61 56.83,23.81 59.06,26.04 v59.06,42.86
BD6  (via drill 0.3)
  Top 0.254: v11.43,40.64 15.24,44.45 IC12.17 20.32,46.04 46.35,46.04 IC9.17 48.89,43.5 v57.15,43.5 83.18,43.5 IC11.16
  Bottom 0.254: IC3.18 11.43,16.83 v11.43,40.64 | U$3.B23 52.39,6.35 53.02,10.16 53.02,13.34 52.07,14.29 52.07,20 54.61,22.54 54.61,25.08 57.15,27.62 v57.15,43.5
BD7  (via drill 0.3)
  Top 0.254: v8.89,40.64 15.24,46.99 IC12.18 27.62,46.99 28.57,47.94 46.99,47.94 IC9.18 47.94,46.35 50.17,44.13 70.48,44.13 71.76,45.4 83.82,45.4 IC11.17
  Bottom 0.254: IC3.19 10.8,13.65 9.52,13.65 8.89,14.29 v8.89,40.64 | U$3.B24 49.85,6.35 50.48,10.48 50.48,13.34 48.89,14.92 48.89,28.26 50.48,29.84 50.48,45.72 49.21,46.99 IC9.18
CLK-3.579  (via drill 0.3)
  Top 0.254: IC12.24 19.69,63.18 37.78,63.18 41.28,59.69 v60.64,59.69 | IC7.6 89.54,37.78 68.9,37.78 66.04,40.64 IC10.14
  Bottom 0.254: v60.64,59.69 63.18,57.15 63.18,50.16 64.77,48.58 64.77,47.31 65.72,46.35 IC10.14
CLK-8
  Top 0.254: IC11.8 78.1,30.16 86.99,30.16 IC7.8
CLK-74  (via drill 0.3)
  Top 0.254: IC8.13 63.5,25.72 v57.47,25.72
  Bottom 0.254: IC1.11 55.56,17.78 IC1.3 55.56,23.81 v57.47,25.72
D0-SN76  (via drill 0.3)
  Top 0.254: IC9.2 41.28,48.58 50.8,48.58 53.02,46.35 v55.24,46.35
  Bottom 0.254: v55.24,46.35 55.56,46.04 IC10.10
D1-SN76
  Top 0.254: IC9.5 40.64,41.59 46.35,41.59 47.63,40.32 51.43,40.32 52.71,39.05 56.52,39.05 IC10.11
D2-SN76
  Top 0.254: IC9.6 41.28,38.42 58.42,38.42 IC10.12
D3-SN76  (via drill 0.3)
  Top 0.254: IC9.9 40.64,31.43 46.35,31.43 46.99,30.8 v60.32,30.8
  Bottom 0.254: v60.32,30.8 61.6,32.07 61.6,38.42 63.18,40.01 IC10.13
D4-SN76  (via drill 0.3)
  Top 0.254: v66.04,31.75 IC9.12
  Bottom 0.254: v66.04,31.75 67.31,33.02 67.31,39.69 IC10.15
D5-SN76  (via drill 0.3)
  Top 0.254: v49.85,45.4 71.12,45.4 71.76,46.04 78.1,46.04 78.74,46.67 78.74,47.62 78.1,48.26 IC10.1
  Bottom 0.254: IC9.15 49.53,40.96 49.53,45.09 v49.85,45.4
D6-SN76  (via drill 0.3)
  Top 0.254: IC9.16 48.26,42.23 v67.31,42.23
  Bottom 0.254: v67.31,42.23 68.26,43.18 IC10.2
D7-SN76
  Top 0.254: IC9.19 48.26,49.85 64.14,49.85 IC10.3
GND  (via drill 0.51)
  Top 0.508: C5.1 C6.1 IC4.2 | IC12.12 2.22,33.02 IC3.14 2.22,30.16 4.13,28.26 35.24,28.26 36.2,29.21 IC9.10 | C28.- C29.- | C13.1 108.9,34.29 C4.1 C1.- U$3.B1 | IC15.3 53.02,64.77 IC15.5 | C3.1 73.34,31.75 v73.98,31.75 | 90.33,66.83 89.85,67.31 C7.1 | 90.33,66.83 C9.2 | IC5.2 82.23,72.39 C10.2 | X1.1 105.41,66.99 90.49,66.99 90.33,66.83 | C21.2 78.42,64.77 C20.- C22.2 69.53,60.96 65.72,60.96 C19.2 | C25.2 94.93,50.8 96.2,50.8 | C23.2 96.2,50.8 | C11.1 107,37.47 103.51,37.47 102.55,38.42 102.55,48.26 100.01,50.8 96.2,50.8
  Bottom 0.508: C31.1 IC9.10 40.32,30.48 41.59,30.48 42.86,31.75 43.5,31.75 45.4,29.84 IC1.7 | IC13.6 25.08,36.83 25.08,49.53 | C28.- 25.08,49.53 | 25.08,49.53 25.08,60.96 23.81,60.96 IC14.4 23.81,63.5 | C2.2 2.22,67.31 2.22,64.14 2.7,63.66 | 2.7,63.66 2.86,63.5 23.81,63.5 | IC12.12 1.27,34.29 1.27,62.23 2.7,63.66 | IC4.2 26.03,69.85 26.03,65.72 23.81,63.5 | C11.1 C13.1 | C1.- U$3.B1 | IC8.7 51.75,35.56 51.75,48.26 IC10.8 54.29,48.26 54.29,49.53 56.83,52.07 56.83,58.1 56.99,58.26 | C18.2 C19.2 62.86,59.69 62.55,60.01 62.55,61.91 60.96,63.5 57.15,63.5 56.99,63.66 | 56.99,58.26 56.83,58.42 56.83,63.5 56.99,63.66 | 56.99,58.26 58.1,58.26 R11.1 | IC15.5 57.15,64.77 56.99,64.61 56.99,63.66 | IC2.8 78.42,25.08 79.06,25.72 79.06,26.67 IC11.9 75.25,26.67 75.25,30.48 v73.98,31.75 74.29,31.75 74.93,32.38 74.93,63.5 C20.- 77.15,66.04 75.88,66.04 C8.1 | IC7.7 88.58,43.18 91.12,45.72 C25.2 | C23.2 C24.2 96.2,57.15 96.2,58.42 92.39,62.23 C9.2 92.39,72.39 IC6.1 | 85.88,68.74 86.04,68.58 C7.1 | 85.88,68.74 C10.2 | C21.2 83.5,64.77 83.5,66.99 84.77,68.26 85.73,68.26 85.73,68.58 85.88,68.74 | C5.1 49.21,66.04 49.21,67.31 IC15.3
  other vias: 6.67,73.03 6.67,66.67 16.83,73.66 16.83,69.85 16.83,66.04
  pour Top: 1.27,75.56 1.27,68.58 5.08,68.58 5.08,64.77 5.4,64.45 23.18,64.45 23.18,75.25 23.18,75.56
  pour Bottom: -0.32,77.15 -0.32,12.06 111.44,12.06 111.44,73.66 107.63,77.47 -0.32,77.47
JACK-ALL
  Bottom 0.254: SV1.1 71.76,16.83 71.76,29.53 71.12,30.16 71.12,35.24 73.34,37.47 C15.+
LEFT-IN
  Top 0.254: R23.2 R22.2 R28.1
  Bottom 0.254: R20.2 R21.2 R22.2 | R28.1 IC15.2
MAP-A13
  Top 0.254: IC3.26 31.43,16.51 32.07,16.51 32.39,16.83 46.35,16.83 IC1.9
MAP-A14  (via drill 0.3)
  Top 0.254: IC3.1 35.56,30.16 45.09,30.16 v49.53,25.72
  Bottom 0.254: v49.53,25.72 50.48,24.77 IC1.5
N$1  (via drill 0.3)
  Top 0.254: IC11.5 76.84,37.15 v72.07,37.15 | R14.2 87.31,53.34 88.26,52.39 88.26,51.44 87.95,51.12 86.99,51.12 85.09,53.02 71.76,53.02 R12.1
  Bottom 0.254: C21.1 R14.2 | v72.07,37.15 71.76,37.47 71.76,51.12 R12.1
N$2  (via drill 0.3)
  Top 0.254: v72.71,39.37 IC11.4 | R15.2 84.45,54.93 71.76,54.93 R13.1
  Bottom 0.254: v72.71,39.37 72.71,53.98 R13.1 72.07,57.15 C22.1
N$3
  Top 0.254: C20.+ 79.69,60.96 R16.1 82.23,59.69 L1.2
  Bottom 0.254: R12.2 R13.2 80.96,58.42 R16.1
N$4
  Bottom 0.254: IC11.6 75.56,35.88 75.56,44.77 76.84,46.04 78.74,46.04 80.96,48.26 R16.2
N$5
  Top 0.254: R32.1 R31.1 69.85,18.73 66.68,18.73 65.72,19.68 C32.+
N$6
  Top 0.254: IC7.1 105.09,40.64 106.36,40.64 | C11.2 106.36,40.64 | 106.36,40.64 R1.1 106.36,46.99 Q1.1
N$7
  Top 0.254: R1.2 IC7.2
  Bottom 0.254: C12.1 101.28,41.91 IC7.2
N$8
  Top 0.254: R2.1 IC7.3
  Bottom 0.254: C12.2 98.74,41.91 IC7.3
N$9  (via drill 0.3)
  Top 0.254: IC9.11 48.89,30.16 v53.34,30.16 | IC8.1 66.68,37.15 57.15,37.15 IC8.6
  Bottom 0.254: v53.34,30.16 55.56,32.38 IC8.6
N$11
  Top 0.254: R15.1 96.2,53.34 100.01,53.34 | C27.+ 100.01,53.34 | 100.01,53.34 C23.1
N$12
  Top 0.254: R14.1 96.2,58.42 100.01,58.42 | C26.+ 100.01,58.42 | 100.01,58.42 C24.1
N$13
  Bottom 0.254: R11.2 50.48,54.29 51.43,53.34 C16.2
N$14  (via drill 0.3)
  Top 0.254: v26.03,47.62 23.18,47.62 IC12.20
  Bottom 0.254: IC13.3 26.03,44.77 v26.03,47.62
N$21
  Bottom 0.254: IC13.4 20.96,47.31 20.96,53.34 19.69,54.61 IC12.21
N$22
  Top 0.254: IC7.4 IC7.5 R2.2 97.47,43.18 101.28,46.99 Q1.2
N$23
  Top 0.254: R3.1 106.36,22.86 Q2.1 | IC7.13 102.87,33.34 107.31,33.34 C13.2
  Bottom 0.254: R3.1 107.63,29.21 C13.2
N$24
  Bottom 0.254: IC13.5 20.32,40.32 20.32,52.7 19.69,53.34 17.78,53.34 17.14,53.98 17.14,58.42 18.42,59.69 IC12.23
N$25  (via drill 0.3)
  Top 0.254: v27.94,48.26 25.08,48.26 C28.+
  Bottom 0.254: IC13.7 27.94,37.78 v27.94,48.26 | C28.+ IC14.5
N$26
  Top 0.254: C14.1 92.71,29.53 96.52,29.53 98.11,31.11 | IC7.12 98.11,31.11 | 98.11,31.11 R3.2
N$27
  Top 0.254: C14.2 90.81,30.16 94.62,30.16 IC7.11
  Bottom 0.254: R4.1 96.2,30.48 IC7.11
N$28
  Top 0.254: L2.1 C18.1 61.91,52.07 C17.-
N$29
  Top 0.254: IC7.10 IC7.9
  Bottom 0.254: 94.93,29.21 93.66,30.48 IC7.10 | 94.93,29.21 101.28,22.86 Q2.2 | 94.93,29.21 R4.2
N$30
  Top 0.254: IC14.2 IC14.1 35.24,62.23 C30.+
N$31
  Bottom 0.254: IC13.2 28.57,44.77 28.57,53.34 27.3,54.61 27.3,61.28 IC14.3
N$34
  Top 0.254: IC14.6 IC14.7 32.7,50.8 C29.+
  Bottom 0.254: IC13.8 32.7,38.1 C29.+
OUT-LEFT  (via drill 0.3)
  Top 0.254: IC15.1 R28.2 | R31.2 76.84,33.34 v81.28,33.34
  Bottom 0.254: v81.28,33.34 81.92,33.97 81.92,60.96 80.96,61.91 80.96,63.5 | 80.96,63.5 80.96,66.04 83.82,68.9 83.82,70.17 86.99,73.34 101.28,73.34 X1.5 | IC15.1 51.43,73.34 71.12,73.34 80.96,63.5
OUT-RIGHT
  Top 0.254: IC15.7 R29.2 62.23,68.26 66.04,68.26 68.26,66.04 89.85,66.04 93.03,62.87 X1.2 103.82,62.87 108.59,58.1 108.59,37.78 107.63,36.83 93.34,36.83 90.17,33.66 90.17,31.43 86.68,27.94 74.93,27.94 74.29,27.3 R32.2
READY-SN76
  Top 0.254: IC8.9 IC8.8
  Bottom 0.254: 59.69,51.75 59.37,52.07 59.37,59.69 R10.1 | 59.69,51.75 IC10.4 | IC8.9 56.52,28.89 56.52,48.58 59.69,51.75
RIGHT-IN
  Top 0.254: R26.2 R27.2 R29.1 IC15.6
  Bottom 0.254: R24.2 R25.2 R26.2
SND-SAA-L
  Top 0.254: R22.1 38.74,65.72 38.74,64.45 40.32,62.87 59.69,62.87 64.45,58.1 92.71,58.1 95.57,55.24 103.19,55.24 C26.-
SND-SAA-R  (via drill 0.3)
  Top 0.254: R26.1 68.9,66.67 73.98,66.67 75.56,68.26 100.65,68.26 v100.96,67.94
  Bottom 0.254: v100.96,67.94 105.09,63.82 105.09,54.61 C27.-
SND-SN
  Top 0.254: C19.1 L2.2 | R21.1 41.28,70.8 67.31,70.8 R25.1
  Bottom 0.254: L2.2 67.31,63.18 67.31,68.9 R25.1
SND-TVC
  Top 0.254: R20.1 41.28,71.44 67.31,71.44 | R24.1 67.31,71.44 | C15.- 70.8,68.9 68.26,71.44 67.31,71.44
SND-YM
  Top 0.254: R27.1 67.31,63.82 41.28,63.82 R23.1
  Bottom 0.254: R23.1 41.59,63.5 C30.-
SNDOUT-SN76
  Top 0.254: C17.+ C16.1
  Bottom 0.254: IC10.7 58.1,50.8 C17.+
SOUND  (via drill 0.3)
  Top 0.254: U$3.A16 v70.8,11.43
  Bottom 0.254: v70.8,11.43 SV1.2
TV-ALL
  Bottom 0.254: C32.- SV1.3
VCC  (via drill 0.51)
  Top 0.508: C2.1 IC12.1 4.76,60.96 v35.24,60.96 | IC9.20 IC9.1 | IC3.27 IC3.28 C31.2 43.18,15.24 45.09,13.34 56.2,13.34 IC1.13 IC1.14 | IC8.14 70.8,30.48 C3.2 | IC1.1 65.09,22.86 v65.72,23.5 66.04,23.81 77.15,23.81 78.1,24.77 89.22,24.77 IC2.3 IC2.2 IC2.1 96.2,16.51 | v89.85,41.91 IC11.18 | 105.09,30.48 IC7.14 | C4.2 105.09,30.48 | 96.2,16.51 IC2.16 | 96.2,16.51 105.09,16.51 | 105.09,16.51 C1.+ U$3.B2 | 105.09,16.51 105.09,30.48
  Bottom 0.508: R10.2 47.94,58.42 IC9.20 | v35.24,60.96 39.05,60.96 40.32,59.69 40.32,56.2 | IC9.1 40.32,56.2 | IC1.14 IC1.1 | IC8.14 65.72,25.4 v65.72,23.5 | v89.85,41.91 89.85,24.13 IC2.3 | C1.+ U$3.B2 | 40.32,56.2 39.05,56.2 36.83,53.98 36.83,20 35.24,18.41 IC3.28

### Text on the board
tPlace: Videoton TVC Multichip Soundcard | Keyboard side | TV | JACK
bPlace: Billentyűzet oldal | Hátsó oldal | v1.3 by Sanyi / 2019